# Altium schematic sheet GPS.SchDoc
size A
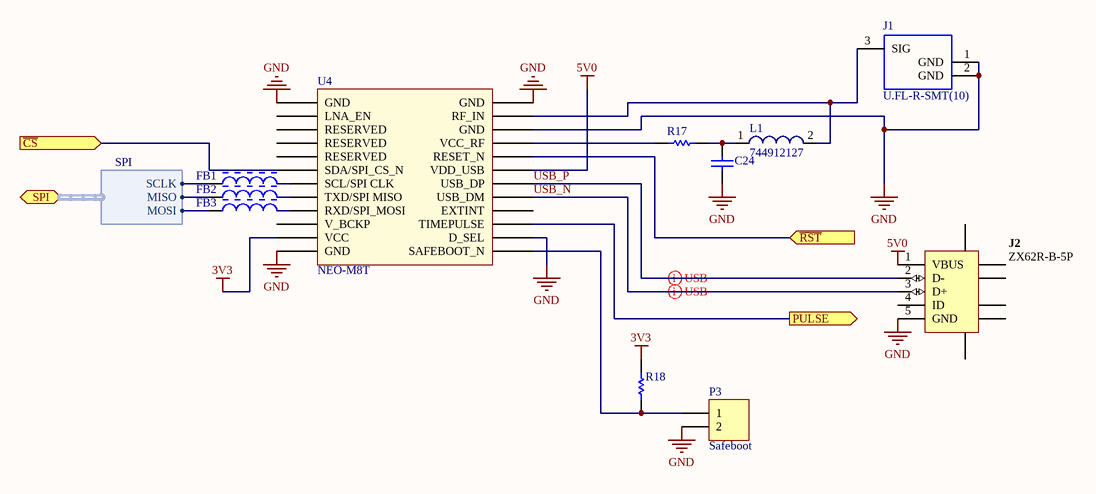
[diagram p0: GPS.SchDoc]

## Parts
C24  CAP 10nF 10V 0603(1608)  [CAPC0603(1608)100_M]  (value not drawn)
FB1  BLM15HD102SN1B  [MURA-BLM15-CHIP-2_V]  (value not drawn)
FB2  BLM15HD102SN1B  [MURA-BLM15-CHIP-2_V]  (value not drawn)
FB3  BLM15HD102SN1B  [MURA-BLM15-CHIP-2_V]  (value not drawn)
J1  U.FL-R-SMT(10)  [HRS-U.FL-R-SMT_V]
J2  ZX62R-B-5P  [HIRO-ZX62R-B-5P_V]
L1  744912127  [WE-CAIR_4248]
P3  Safeboot  [HDR1X2]
R17  10R 5% 0603(1608)  [RESC0603(1608)_L]  (value not drawn)
R18  1M 5% 0603(1608)  [RESC0603(1608)_N]  (value not drawn)
U4  NEO-M8T  [NEO]

## Ports
PULSE (out), SPI (harness SPI), ~{CS} (in), ~{RST} (in)

## Harnesses
SPI: MISO, MOSI, SCLK

## Nets
3V3: R18.2 U4.23(VCC)
5V0: J2.1(VBUS) U4.7(VDD_USB)
GND: C24.2 J1.1(GND) J1.2(GND) J2.5(GND) P3.2 U4.2(D_SEL) U4.10(GND) U4.12(GND) U4.13(GND) U4.24(GND)
~{CS}: U4.18(SDA/SPI_CS_N) ; port ~{CS}
~{RST}: U4.8(RESET_N) ; port ~{RST}
PULSE: U4.3(TIMEPULSE) ; port PULSE
USB_N: J2.3(D+) U4.5(USB_DM)
USB_P: J2.2(D-) U4.6(USB_DP)
NetC24_1: C24.1 L1.1 R17.2
NetFB1_1: FB1.1 ; port SPI.SCLK
NetFB1_2: FB1.2 U4.19(SCL/SPI_CLK)
NetFB2_1: FB2.1 ; port SPI.MISO
NetFB2_2: FB2.2 U4.20(TXD/SPI_MISO)
NetFB3_1: FB3.1 ; port SPI.MOSI
NetFB3_2: FB3.2 U4.21(RXD/SPI_MOSI)
NetJ1_3: J1.3(SIG) L1.2 U4.11(RF_IN)
NetP3_1: P3.1 R18.1 U4.1(SAFEBOOT_N)
NetR17_1: R17.1 U4.9(VCC_RF)

Not connected (* = marked no-connect by the designer): J2 4(ID) 6(SHLD) 7(SHLD) 8(SHLD) 9(SHLD) 10(SHLD) 11(SHLD); U4 4(EXTINT) 14(LNA_EN) 15(RESERVED) 16(RESERVED) 17(RESERVED) 22(V_BCKP)

## Layout directives
differential pair: USB_N, USB_P

## Library data of the parts
C24 = CMP-1035-02306-1: CAP 10nF 10V ±10% 0603 (1608 Metric) Thickness 1mm SMD; Tolerance: Â±10%; Case-EIA: 0603; Case-Metric: 1608; Rated Voltage: 10 V; Technology: SMT; Value: 10nF; Max Thickness: 1 mm
FB1-FB3 = CMP-0686-00278-3: Chip Ferrite Bead for GHz Band High-speed Signal Lines, 1000 Ohm, 250 mA, -55 to 125 degC, 1 x 0.5 x 0.55 mm SMD, Bulk; Manufacturer: Murata; DC Resistance: 1.25 Ohm Max.; Rated Current: 250 mA; Impedance (at 100 MHz): 1000 Ohm +/- 25%; Operating Temperature Range: -55 to 125 degC; ComponentLink3Description: Package Specification; Packing: Bulk; PackageReference: BLM15-2; DatasheetVersion: 08/2013; PartNumber: BLM15HD102SN1B; ComponentLink1Description: Manufacturer URL; ComponentLink1URL: http://www.murata.com/; Mounting Technology: Surface Mount; ComponentLink2Description: Datasheet; ComponentLink2URL: http://www.murata.com/products/catalog/pdf/c31e.pdf; PackageDescription: 2-Pin Chip, Body 1 x 0.5 mm; ComponentLink3URL: http://www.murata.com/products/catalog/pdf/c31e.pdf
J1 = CMP-0029-00003-1: Ultra Small Surface Mount Coaxial Connector, 50 Ohm, -40 to 90 degC, 3-Pin SMD, RoHS, Tape and Reel; Current Rating: 3 A; DatasheetVersion: Aug-16; Mount: Through Hole; Contact Material: Bronze; Length: 101.19 mm; Radiation Hardening: No; Height: 8.13 mm; ComponentLink1Description: Manufacturer URL; Pins: 80; Package Quantity: 50; ComponentLink2URL: https://www.hirose.com/product/en/download_file/key_name/U.FL/category/Catalog/doc_file_id/31697/?file_category_id=4&item_id=15&is_series=1; Lead Pitch: 2.54 mm; Max Operating Temperature: 105degC; Width: 4.88 mm; RoHSCompliant: True; Contact Plating: Tin; PackageReference: U.FL-R-SMT; Packaging: Bulk; Contact Finish: Lead; PackageDescription: 3-Pin Surface Mount Device, Body 2.6 x 2.6 mm; Min Operating Temperature: -65degC; ComponentLink1URL: https://www.hirose.com; ComponentLink2Description: Datasheet; Colour: Black
J2 = CMP-0031-00001-1: Connector; USBMicro-B,Reverse type, SMT; 5 Position; Right Angle; DatasheetVersion: 08/2010; Operating Temperature: -30 to 85 degC; Mounting Technology: Surface Mount; PartNumber: ZX62R-B-5P; PackageReference: ZX62R-B-5P; ComponentLink2URL: http://www.hirose.co.jp/cataloge_hp/e24200011.pdf; ComponentLink1URL: http://www.hirose.com/â€Ž; ComponentLink2Description: Datasheet; PackageDescription: 5-Pin USB Micro-B R/A Connector; ComponentLink1Description: Manufacturer URL
L1 = CMP-1497-00015-1: WE-CAIR Air Coil, L=27 nH; Manufacturer: Wuerth Elektronik; Inductance: 27 nH; ComponentLink2URL: http://katalog.we-online.de/kataloge/eisos/media/pdf/744912127.pdf; ComponentLink2Description: Datasheet; PartNumber: 744912127; PackageReference: WE-CAIR_4248; ComponentLink1URL: http://www.we-online.com; ComponentLink1Description: Manufacturer URL
P3 = Header 2: Header, 2-Pin; LatestRevisionDate: 17-Jul-2002; LatestRevisionNote: Re-released for DXP Platform.; Publisher: Altium Limited
R17 = CMP-1012-00026-1: 10R 0.1W 5% 0603 (1608 Metric)  SMD; Case-EIA: 0603; Value: 10.00 Ohm; Case-Metric: 1608; Power: 0.1 W; Tolerance: 5 %; Technology: SMT
R18 = CMP-1012-00146-1: 1M 0.1W 5% 0603 (1608 Metric)  SMD; Case-EIA: 0603; Value: 1000000.00 Ohm; Case-Metric: 1608; Power: 0.1 W; Tolerance: 5 %; Technology: SMT
U4 = NEO: u-blox NEO GNSS module; Part Description: u-blox GNSS module; Value: NEO-M8; Manufacturer: u-blox